# EAGLE board Mobo-v07 (EAGLE 5.09)
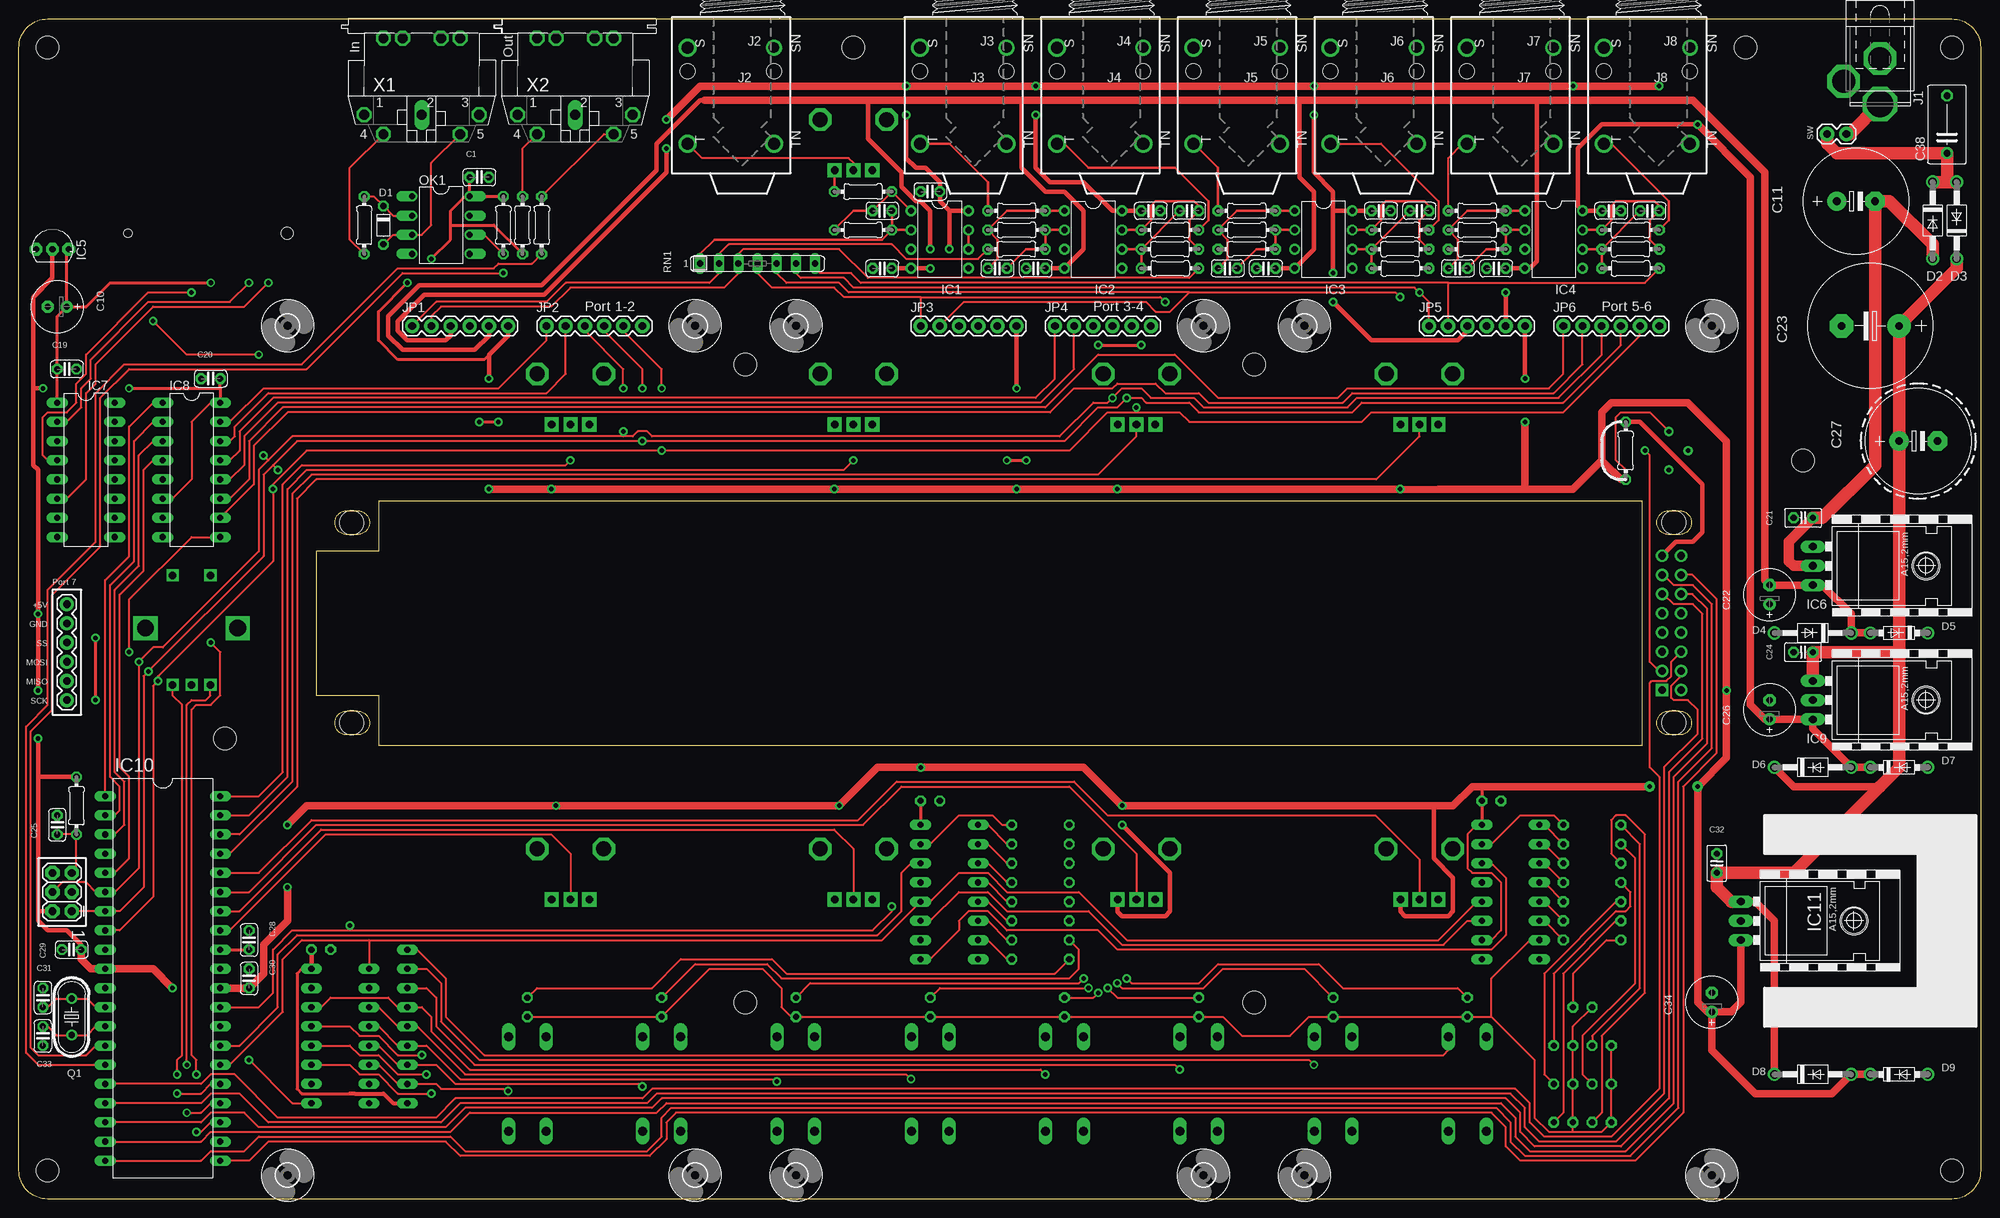
[diagram p5: board, top side]
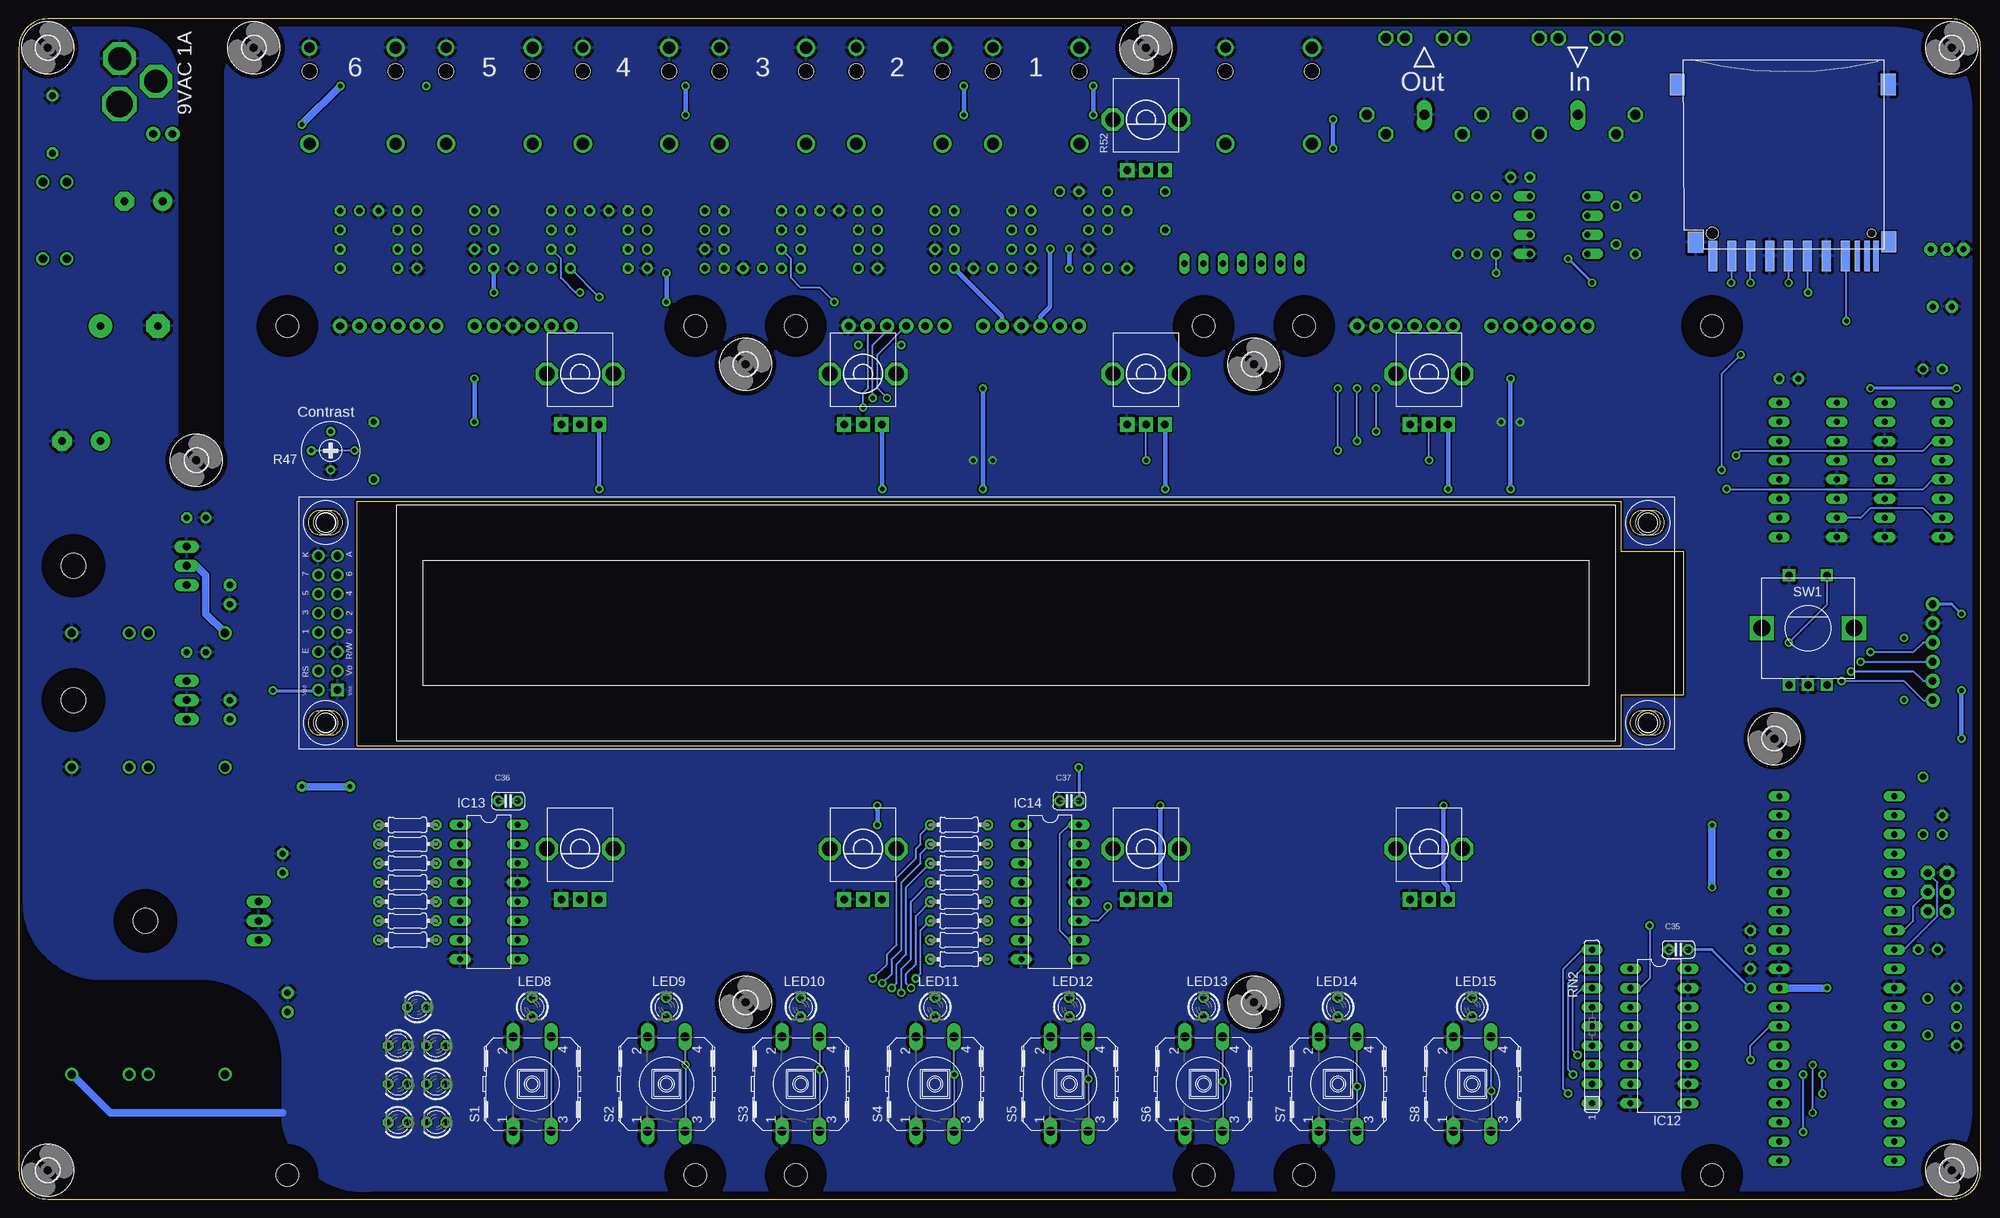
[diagram p6: board, bottom side, seen from below]

Size 259.71 x 156.21 mm. Coordinates in mm from the lower left corner, seen from the top.
Outline: 0,152.4 arc-90 3.81,156.21 255.91,156.21 arc-90 259.71,152.4 259.71,3.81 arc-90 255.91,0 3.81,0 arc-90 0,3.81 0,152.4
Outline: 214.95,60.01 214.95,92.39 47.62,92.39 47.62,85.72 39.37,85.72 39.37,66.67 47.62,66.67 47.62,60.01 214.95,60.01
Copper layers (1*16): Top 0.035mm / dielectric 1.5mm / Bottom 0.035mm
Design rules "SparkFun *": minimum track width 8mil, minimum drill 20mil, track to track 8mil, track to pad 8mil, pad to pad 8mil, via to via 8mil, smd to smd 8mil, copper to edge 10mil, drill to drill 8mil, minimum pad ring 12mil, minimum via ring 10mil, stop-mask expansion 4mil, vias tented up to drill 25mil, thermal gap 16mil

## Footprints (pad centres in the part's own frame; a part is rotated, then mirrored left to right if it is on the bottom)
C025-024X044 = drill 0.813 octagon: 1 -1.27,0; 2 1.27,0
E2,5-7 = drill 0.813 pad 1.6 round: + -1.27,0 | drill 0.813 pad 1.6 octagon: - 1.27,0
E5-13 = drill 1.016 pad 2.54 round: + -2.54,0 | drill 1.016 pad 2.54 octagon: - 2.54,0
C025-025X050 = drill 0.813 octagon: 1 -1.27,0; 2 1.27,0
E7,5-16 = drill 1.016 pad 3.15 round: + -3.81,0 | drill 1.016 pad 3.15 octagon: - 3.81,0
C075-052X106 = drill 0.914 octagon: 1 -3.81,0; 2 3.81,0
D-5 = drill 0.813 octagon: A 2.54,0; C -2.54,0
DO41-10 = drill 1.118 round: A 5.08,0; C -5.08,0
DO41-7.6 = drill 1.1 pad 1.7 round: A 3.81,0; C -3.81,0
DIL08 = drill 0.813 pad 1.27 round: 1 -3.81,-3.81; 2 -1.27,-3.81; 3 1.27,-3.81; 4 3.81,-3.81; 5 3.81,3.81; 6 1.27,3.81; 7 -1.27,3.81; 8 -3.81,3.81
TO92-INLINE = drill 0.813 pad 1.676 octagon: 1 -2.159,0; 2 0,0; 3 2.159,0
79XXL = drill 1.016 long: GND -2.54,-3.81; IN 0,-3.81; OUT 2.54,-3.81 | hole 3.302: 0,11.176
DIL16 = drill 0.813 long: 1 -8.89,-3.81; 2 -6.35,-3.81; 3 -3.81,-3.81; 4 -1.27,-3.81; 5 1.27,-3.81; 6 3.81,-3.81; 7 6.35,-3.81; 8 8.89,-3.81; 9 8.89,3.81; 10 6.35,3.81; 11 3.81,3.81; 12 1.27,3.81; 13 -1.27,3.81; 14 -3.81,3.81; 15 -6.35,3.81; 16 -8.89,3.81
78XXL = drill 1.016 long: GND 0,-3.81; IN -2.54,-3.81; OUT 2.54,-3.81 | hole 3.302: 0,11.176
DIL40 = drill 0.813 long: 1 -24.13,-7.62; 2 -21.59,-7.62; 3 -19.05,-7.62; 4 -16.51,-7.62; 5 -13.97,-7.62; 6 -11.43,-7.62; 7 -8.89,-7.62; 8 -6.35,-7.62; 9 -3.81,-7.62; 10 -1.27,-7.62; 11 1.27,-7.62; 12 3.81,-7.62; 13 6.35,-7.62; 14 8.89,-7.62; 15 11.43,-7.62; 16 13.97,-7.62; 17 16.51,-7.62; 18 19.05,-7.62; 19 21.59,-7.62; 20 24.13,-7.62; 21 24.13,7.62; 22 21.59,7.62; 23 19.05,7.62; 24 16.51,7.62; 25 13.97,7.62; 26 11.43,7.62; 27 8.89,7.62; 28 6.35,7.62; 29 3.81,7.62; 30 1.27,7.62; 31 -1.27,7.62; 32 -3.81,7.62; 33 -6.35,7.62; 34 -8.89,7.62; 35 -11.43,7.62; 36 -13.97,7.62; 37 -16.51,7.62; 38 -19.05,7.62; 39 -21.59,7.62; 40 -24.13,7.62
SPC4078_BIG_HOLES = drill 3.023 pad 4.318 octagon: 1 -0.46,0; 2 2.54,-4.8 | drill 3.531 pad 4.572 octagon: 3 5.54,0
NRJ4HF = drill 1.6 round: S 5.08,7.992; T -7.62,7.992; TN -7.62,-3.438 | drill 1.4 round: SN 5.08,-3.438 | hole 2: 1.948,7.992; 1.948,-3.438
1X06 = drill 1.016 pad 1.88 round: 1 0,0; 2 2.54,0; 3 5.08,0; 4 7.62,0; 5 10.16,0; 6 12.7,0
LED3MM = drill 0.813 octagon: A -1.27,0; K 1.27,0
DIL08' = drill 0.813 offset: 1 -3.81,-3.81; 2 -1.27,-3.81; 3 1.27,-3.81; 4 3.81,-3.81; 5 3.81,3.81; 6 1.27,3.81; 7 -1.27,3.81; 8 -3.81,3.81
HC49U-V = drill 0.813 round: 1 -2.413,0; 2 2.413,0
0204/7 = drill 0.813 octagon: 1 -3.81,0; 2 3.81,0
ALPS_POT_VERTICAL = drill 1 pad 1.88 square: P$1 -2.5,6.7; P$2 0,6.7; P$3 2.5,6.7 | drill 2 octagon: P$4 -4.4,0; P$5 4.4,0
RTRIM3339P = drill 0.61 round: 1 -2.54,0; 2 0,-2.54; 3 2.54,0
SIL7 = drill 0.813 long: 1 -7.62,0; 2 -5.08,0; 3 -2.54,0; 4 0,0; 5 2.54,0; 6 5.08,0; 7 7.62,0
SIL9 = drill 0.813 long: 1 -10.16,0; 2 -7.62,0; 3 -5.08,0; 4 -2.54,0; 5 0,0; 6 2.54,0; 7 5.08,0; 8 7.62,0; 9 10.16,0
B3F-40XX = drill 1.194 long: 1 -6.248,2.489; 2 6.248,2.489; 3 -6.248,-2.489; 4 6.248,-2.489
1X02 = drill 1.016 pad 1.88 round: 1 0,0; 2 2.54,0
ALPS_EC12E_SW = drill 1 square: A -2.5,-7.5; B 2.5,-7.5; C 0,-7.5; D -2.5,7; E 2.5,7 | drill 2.2 square: GND1 -6.1,0; GND2 6.1,0
2X3 = drill 1.016 pad 1.88 octagon: 1 0,0; 2 0,2.54; 3 2.54,0; 4 2.54,2.54; 5 5.08,0; 6 5.08,2.54
3,0 = hole 3: 0,0
LCD_MODULE_2X40 = drill 1.016 square: 1 1.54,-22.16 | drill 1.016 round: 2 -1,-22.16; 3 1.54,-19.62; 4 -1,-19.62; 5 1.54,-17.08; 6 -1,-17.08; 7 1.54,-14.54; 8 -1,-14.54; 9 1.54,-12; 10 -1,-12; 11 1.54,-9.46; 12 -1,-9.46; 13 1.54,-6.92; 14 -1,-6.92; 15 1.54,-4.38; 16 -1,-4.38 | hole 3.2: 0,-26.5; 175,-26.5; 175,0; 0,0.018
06132 = smd 1.2 x 4: 1 6.9,0.9; 2 4.4,0.9; 3 1.9,0.9; 4 -0.6,0.9; 5 -3.1,0.9; 6 -5.6,0.9; 7 -8.1,0.9; 9 9.4,0.9 | smd 0.7 x 4: 8 -9.7,0.9; CD -11,0.9; WP -12.2,0.9 | smd 2 x 2.8: GP -13.8,-21.8; GP2 14.1,-21.8; GP3 11.7,-0.9; GP4 -13.9,-1 | hole 1.1: -11.6,-2.1 | hole 1.6: 9.5,-2.1
MAB5SH = drill 1.321 octagon: 1 7.62,7.62; 3 -7.62,7.62; 4 5.08,10.16; 5 -5.08,10.16; P$1 -5.08,-2.54; P$2 -2.54,-2.54; P$3 2.54,-2.54; P$4 5.08,-2.54 | drill 1.321 long: 2 0,7.62

## Placement (x,y rotation side)
C1  100n  [C025-024X044]  60.96,135.25 0 top
C2  100n  [C025-024X044]  120.65,133.35 180 top
C3  100p  [C025-024X044]  114.3,130.81 180 top
C4  100n  [C025-024X044]  149.86,130.81 0 top
C5  100p  [C025-024X044]  154.94,130.81 0 top
C6  100n  [C025-024X044]  180.34,130.81 0 top
C7  100p  [C025-024X044]  185.42,130.81 0 top
C8  100n  [C025-024X044]  210.82,130.81 0 top
C9  100p  [C025-024X044]  215.9,130.81 0 top
C10  100u  [E2,5-7]  5.08,118.11 180 top
C11  2200u  [E5-13]  243.21,132.08 0 top
C12  100n  [C025-024X044]  114.3,123.19 0 top
C13  100p  [C025-024X044]  129.54,123.19 180 top
C14  100n  [C025-024X044]  134.62,123.19 0 top
C15  100p  [C025-024X044]  160.02,123.19 180 top
C16  100n  [C025-024X044]  165.1,123.19 0 top
C17  100p  [C025-024X044]  190.5,123.19 180 top
C18  100n  [C025-024X044]  195.58,123.19 0 top
C19  100n  [C025-024X044]  6.35,109.86 0 top
C20  100n  [C025-024X044]  25.4,108.58 180 top
C21  100n  [C025-025X050]  236.22,90.17 0 top
C22  100u  [E2,5-7]  231.78,80.01 90 top
C23  4700u  [E7,5-16]  245.11,115.57 180 top
C24  100n  [C025-025X050]  236.22,72.39 180 top
C25  100n  [C025-024X044]  5.08,49.53 90 top
C26  100u  [E2,5-7]  231.78,64.77 90 top
C27  2200u  [E5-13]  251.46,100.33 0 top
C28  100n  [C025-024X044]  30.48,34.29 90 top
C29  100n  [C025-024X044]  6.98,33.02 180 top
C30  100n  [C025-024X044]  30.48,29.21 90 top
C31  18p  [C025-024X044]  3.17,26.67 270 top
C32  100n  [C025-025X050]  224.79,44.45 90 top
C33  18p  [C025-024X044]  3.17,21.59 90 top
C34  100u  [E2,5-7]  224.16,26.04 90 top
C35  100n  [C025-024X044]  40.01,33.02 180 bottom
C36  100n  [C025-024X044]  194.94,52.7 180 bottom
C37  100n  [C025-024X044]  120.65,52.7 180 bottom
C38  1u  [C075-052X106]  255.27,142.24 90 top
D1  1N4148  [D-5]  48.26,128.91 270 top
D2  1N4004  [DO41-10]  253.36,129.54 270 top
D3  1N4004  [DO41-10]  256.54,129.54 90 top
D4  1N4004  [DO41-10]  237.49,74.93 180 top
D5  1N5819  [DO41-7.6]  248.92,74.93 180 top
D6  1N4004  [DO41-10]  237.49,57.15 0 top
D7  1N5819  [DO41-7.6]  248.92,57.15 0 top
D8  1N4004  [DO41-10]  237.49,16.51 0 top
D9  1N5819  [DO41-7.6]  248.92,16.51 0 top
IC1  TL072  [DIL08]  121.92,127 270 top
IC2  TL072  [DIL08]  142.24,127 270 top
IC3  TL072  [DIL08]  172.72,127 270 top
IC4  TL072  [DIL08]  203.2,127 270 top
IC5  MCP1700  [TO92-INLINE]  4.44,125.73 0 top
IC6  7908  [79XXL]  241.3,83.82 270 top
IC7  4050N  [DIL16]  8.89,96.52 270 top
IC8  74HC138N  [DIL16]  22.86,96.52 270 top
IC9  2940T-8.0  [78XXL]  241.3,66.04 270 top
IC10  ATMEGA644p  [DIL40]  19.05,29.21 270 top
IC11  7805  [78XXL]  231.78,36.83 270 top
IC12  74HC165N  [DIL16]  42.55,21.59 270 bottom
IC13  74HC595N  [DIL16]  197.49,40.64 270 bottom
IC14  74HC595N  [DIL16]  123.19,40.64 270 bottom
J1  [SPC4078_BIG_HOLES]  246.38,150.5 270 top
J2  MONOSWSLIM  [NRJ4HF]  96.52,147.32 90 top
J3  MONOSWSLIM  [NRJ4HF]  127.32,147.32 90 top
J4  MONOSWSLIM  [NRJ4HF]  145.41,147.32 90 top
J5  MONOSWSLIM  [NRJ4HF]  163.51,147.32 90 top
J6  MONOSWSLIM  [NRJ4HF]  181.61,147.32 90 top
J7  MONOSWSLIM  [NRJ4HF]  199.71,147.32 90 top
J8  MONOSWSLIM  [NRJ4HF]  217.81,147.32 90 top
JP1  [1X06]  52.07,115.57 0 top
JP2  [1X06]  69.85,115.57 0 top
JP3  [1X06]  119.38,115.57 0 top
JP4  [1X06]  137.16,115.57 0 top
JP5  [1X06]  186.69,115.57 0 top
JP6  [1X06]  204.47,115.57 0 top
JP7  [1X06]  6.35,66.04 90 top
LED1  [LED3MM]  209.55,10.16 180 bottom
LED2  [LED3MM]  204.47,10.16 180 bottom
LED3  [LED3MM]  209.55,15.24 180 bottom
LED4  [LED3MM]  204.47,15.24 180 bottom
LED5  [LED3MM]  209.55,20.32 180 bottom
LED6  [LED3MM]  204.47,20.32 180 bottom
LED7  [LED3MM]  207.01,25.4 180 bottom
LED8  [LED3MM]  191.77,25.4 270 bottom
LED9  [LED3MM]  173.99,25.4 270 bottom
LED10  [LED3MM]  156.21,25.4 270 bottom
LED11  [LED3MM]  138.43,25.4 270 bottom
LED12  [LED3MM]  120.65,25.4 270 bottom
LED13  [LED3MM]  102.87,25.4 270 bottom
LED14  [LED3MM]  85.09,25.4 270 bottom
LED15  [LED3MM]  67.31,25.4 270 bottom
OK1  6N137  [DIL08']  55.88,128.91 270 top
Q1  20MHz  [HC49U-V]  6.98,24.13 90 top
R1  68  [0204/7]  111.76,133.35 180 top
R2  68  [0204/7]  132.08,130.81 180 top
R3  68  [0204/7]  162.56,130.81 180 top
R4  68  [0204/7]  193.04,130.81 180 top
R5  220  [0204/7]  45.72,128.91 90 top
R6  10k  [0204/7]  64.14,128.91 90 top
R8  220  [0204/7]  66.67,128.91 270 top
R9  220  [0204/7]  69.22,128.91 90 top
R10  10k  [0204/7]  111.76,128.27 180 top
R11  10k  [0204/7]  132.08,128.27 180 top
R12  68  [0204/7]  152.4,128.27 0 top
R13  10k  [0204/7]  162.56,128.27 180 top
R14  68  [0204/7]  182.88,128.27 0 top
R15  10k  [0204/7]  193.04,128.27 180 top
R16  68  [0204/7]  213.36,128.27 0 top
R17  10k  [0204/7]  132.08,125.73 0 top
R18  10k  [0204/7]  152.4,125.73 0 top
R19  10k  [0204/7]  162.56,125.73 0 top
R20  10k  [0204/7]  182.88,125.73 0 top
R21  10k  [0204/7]  193.04,125.73 0 top
R22  10k  [0204/7]  213.36,125.73 0 top
R23  10k  [0204/7]  152.4,123.19 180 top
R24  10k  [0204/7]  182.88,123.19 180 top
R25  10k  [0204/7]  213.36,123.19 180 top
R26  0  [0204/7]  212.72,99.06 90 top
R27  10k  [0204/7]  7.62,52.07 90 top
R28  470  [0204/7]  135.25,31.75 180 bottom
R29  470  [0204/7]  208.28,34.29 180 bottom
R30  470  [0204/7]  135.25,34.29 180 bottom
R31  470  [0204/7]  208.28,36.83 180 bottom
R32  470  [0204/7]  135.25,36.83 180 bottom
R33  470  [0204/7]  208.28,39.37 180 bottom
R34  470  [0204/7]  135.25,39.37 180 bottom
R35  470  [0204/7]  208.28,41.91 180 bottom
R36  470  [0204/7]  135.25,41.91 180 bottom
R37  470  [0204/7]  208.28,44.45 180 bottom
R38  470  [0204/7]  135.25,44.45 180 bottom
R39  POT  [ALPS_POT_VERTICAL]  185.42,46.35 180 bottom
R40  POT  [ALPS_POT_VERTICAL]  147.96,46.35 180 bottom
R41  POT  [ALPS_POT_VERTICAL]  110.49,46.35 180 bottom
R42  POT  [ALPS_POT_VERTICAL]  73.03,46.35 180 bottom
R43  470  [0204/7]  208.28,46.99 180 bottom
R44  470  [0204/7]  135.25,46.99 180 bottom
R45  470  [0204/7]  208.28,49.53 180 bottom
R46  470  [0204/7]  135.25,49.53 180 bottom
R47  5k  [RTRIM3339P]  218.44,99.06 270 bottom
R48  POT  [ALPS_POT_VERTICAL]  185.42,109.22 180 bottom
R49  POT  [ALPS_POT_VERTICAL]  147.96,109.22 180 bottom
R50  POT  [ALPS_POT_VERTICAL]  110.49,109.22 180 bottom
R51  POT  [ALPS_POT_VERTICAL]  73.03,109.22 180 bottom
R52  100kA  [ALPS_POT_VERTICAL]  110.49,142.88 180 bottom
RN1  10k  [SIL7]  97.79,123.83 0 top
RN2  10k  [SIL9]  51.44,22.86 90 bottom
S1  [B3F-40XX]  191.77,15.24 90 bottom
S2  [B3F-40XX]  173.99,15.24 90 bottom
S3  [B3F-40XX]  156.21,15.24 90 bottom
S4  [B3F-40XX]  138.43,15.24 90 bottom
S5  [B3F-40XX]  120.65,15.24 90 bottom
S6  [B3F-40XX]  102.87,15.24 90 bottom
S7  [B3F-40XX]  85.09,15.24 90 bottom
S8  [B3F-40XX]  67.31,15.24 90 bottom
SW  [1X02]  241.94,140.97 180 top
SW1  Encoder  [ALPS_EC12E_SW]  22.86,75.56 0 bottom
U1  ISP  [2X3]  6.98,38.1 90 top
U$1  [SARASWATI_LARGE]  11.43,133.35 0 top
U$2  [D02A-L]  247.02,83.82 180 top
U$3  [D02A-L]  247.02,66.04 180 top
U$4  [D02A-L]  237.49,36.83 180 top
U$5  [3,0]  224.16,3.18 0 top
U$6  [3,0]  170.18,3.18 0 top
U$7  [3,0]  156.84,3.18 0 top
U$8  [3,0]  102.87,3.18 0 top
U$9  [3,0]  89.53,3.18 0 top
U$10  [3,0]  35.56,3.18 0 top
U$11  [3,0]  255.91,3.81 0 bottom
U$12  [3,0]  3.81,3.81 0 bottom
U$13  LCD_MODULE  [LCD_MODULE_2X40]  219.07,89.53 0 bottom
U$14  [3,0]  27.3,60.96 0 bottom
U$15  [3,0]  224.16,115.57 0 top
U$16  [3,0]  170.18,115.57 0 top
U$17  [3,0]  156.84,115.57 0 top
U$18  [3,0]  102.87,115.57 0 top
U$19  [3,0]  89.53,115.57 0 top
U$20  [3,0]  35.56,115.57 0 top
U$21  [3,0]  96.2,110.49 0 bottom
U$22  SDMMC06132  [06132]  26.04,125.73 180 bottom
U$23  [3,0]  255.91,152.4 0 bottom
U$24  [3,0]  228.6,152.4 0 bottom
U$25  [3,0]  110.49,152.4 0 bottom
U$26  [3,0]  3.81,152.4 0 bottom
U$27  [3,0]  163.51,110.49 0 bottom
U$28  [3,0]  163.51,26.04 0 bottom
U$29  [3,0]  96.2,26.04 0 bottom
U$30  [3,0]  236.22,97.79 0 bottom
X1  MIDI  [MAB5SH]  53.34,151.13 180 top
X2  MIDI  [MAB5SH]  73.66,151.13 180 top

## Tracks (layer width: path | path; a pad name or v marks a point on that pad's centre or on a via)
+3V3  (via drill 0.6)
  Top 0.406: IC7.1 C19.1 5.08,116.84 C10.+ | IC5.3 6.35,125.48 C10.+ | C10.+ 8.89,118.11 12.06,121.28 v25.4,121.28
  Bottom 0.254: 25.44,125.13 U$22.4 25.4,124.79 v25.4,121.28
+5V  (via drill 0.6, 0.6 pad 1.42)
  Top 0.254: IC8.6 20.32,92.71 22.86,95.25 22.86,102.87 25.4,105.41 | IC13.10 194.94,34.29 196.22,35.56 196.22,41.91 194.94,43.18 192.41,43.18 191.77,43.81 191.77,48.26 193.04,49.53 | R47.1 215.9,104.14 212.09,104.14 211.46,103.5 211.46,97.79 212.72,96.52 R26.1
  Top 0.406: OK1.8 R6.2 | C37.1 IC14.16 | 44.45,13.97 37.47,13.97 36.83,14.6 36.83,29.85 37.47,30.48 IC12.16 | 193.04,49.53 IC13.16 C36.1 193.68,54.61 | 25.4,105.41 IC8.16 26.67,107.31 | OK1.8 C1.1 | v51.44,121.28 47.62,117.47 47.62,113.66 50.17,111.12 61.59,111.12 62.23,111.76 | v54.61,124.46 57.15,127 57.15,128.91 | 57.15,128.91 57.15,130.81 59.06,132.72 OK1.8 | v14.6,107.31 26.67,107.31 | 26.67,107.31 C20.1 | R8.2 62.86,128.91 57.15,128.91
  Top 0.508: 43.81,13.97 44.45,13.97 48.26,13.97 49.53,12.7 RN2.1
  Top 0.61: C35.1 IC12.16 | v199.39,108.58 JP5.6 | v132.08,107.31 JP3.6 | v2.54,67.31 v2.54,77.47 2.54,96.52 1.9,97.16 1.9,107.31 | v62.23,108.58 62.23,111.76 64.77,114.3 JP1.6 | C29.1 8.26,33.66 6.35,35.56 3.81,35.56 2.54,36.83 2.54,38.1 | 2.54,38.1 2.54,55.88 | 2.54,55.88 v2.54,60.96 | 2.54,38.1 U1.2 | 2.54,55.88 R27.2 | 1.9,107.31 v3.17,107.31 | 1.9,107.31 1.9,119.38 4.44,121.92 IC5.2 | R39.P$1 182.88,39.61 182.88,38.1 183.52,37.46 189.23,37.46 189.87,38.1 189.87,42.54 187.32,45.09 187.32,52.07 | v146.05,49.53 152.4,43.18 152.4,38.1 151.77,37.46 146.05,37.46 145.46,38.06 R40.P$1
  Top 0.914: v182.88,93.98 187.96,93.98
  Top 1.016: v20.32,27.94 17.78,30.48 IC10.10 9.53,30.48 8.26,31.75 C29.1 | v35.56,49.53 38.1,52.07 v71.12,52.07 v108.59,52.07 113.67,57.15 v119.38,57.15 140.97,57.15 v146.05,52.07 187.32,52.07 189.87,52.07 192.41,54.61 193.68,54.61 v215.9,54.61 214,54.61 | v35.56,41.27 35.56,36.83 32.38,33.66 32.38,29.85 C30.1 IC10.30 | v182.88,93.98 v145.41,93.98 v132.08,93.98 v107.95,93.98 v70.48,93.98 v62.23,93.98 | 187.96,93.98 199.39,93.98 | 199.39,93.98 v199.39,102.87 | C34.+ 223.52,24.77 222.25,26.04 v222.25,54.61 226.06,58.42 v226.06,67.31 226.06,100.33 220.98,105.41 210.82,105.41 209.55,104.14 209.55,97.79 209.23,97.47 | IC11.OUT 227.97,26.04 226.69,24.77 C34.+ | D9.C D8.A 240.03,13.97 229.87,13.97 224.16,19.69 C34.+ | 199.39,93.98 205.74,93.98 209.23,97.47 | R26.1 212.09,95.25 209.87,97.47 209.23,97.47
  Bottom 0.254: IC14.10 120.65,34.29 121.92,35.56 121.92,48.26 120.65,49.53
  Bottom 0.406: v119.38,57.15 C37.1 | IC14.16 120.65,49.53 | v2.54,77.47 3.81,78.74 JP7.6 | v51.44,121.28 v54.61,124.46 | v3.17,107.31 v14.6,107.31 | C35.1 35.56,33.02 C30.1 | v226.06,67.31 220.14,67.31
  Bottom 0.61: R51.P$1 70.48,102.48 v70.48,93.98 70.53,94.02 | v71.12,52.07 71.12,41.91 70.53,41.31 R42.P$1 | v108.59,52.07 108.59,41.91 107.99,41.31 R41.P$1 | v107.95,93.98 107.95,102.48 R50.P$1 | v145.41,93.98 145.41,102.48 R49.P$1 | v182.88,93.98 182.88,102.48 R48.P$1 | v62.23,93.98 v62.23,108.58 | v199.39,102.87 v199.39,108.58 | v132.08,107.31 v132.08,93.98 | v2.54,60.96 v2.54,67.31 | v146.05,52.07 v146.05,49.53
  Bottom 1.016: IC10.30 v20.32,27.94 | v35.56,49.53 v35.56,41.27 | v222.25,54.61 v215.9,54.61 | 220.14,67.31 U$13.2
AUDIO0
  Top 0.254: R17.1 127,124.46 117.47,124.46 115.57,126.37 93.98,126.37 92.71,125.09 RN1.2 92.71,122.55 91.44,121.28 72.39,121.28 69.85,118.75 55.25,118.75 JP1.1
AUDIO1
  Top 0.254: R23.1 154.94,121.92 112.39,121.92 108.59,125.73 95.89,125.73 95.25,125.09 RN1.3 95.25,122.55 93.34,120.65 73.03,120.65 70.48,118.11 55.88,118.11 54.61,116.84 JP1.2
AUDIO2  (via drill 0.6)
  Top 0.254: v151.77,118.75 151.13,119.38 119.38,119.38 | 119.38,119.38 JP3.1 | 119.38,119.38 109.22,119.38 107.95,120.65 99.7,120.65 97.79,122.55 RN1.4
  Bottom 0.254: v151.77,118.75 153.67,120.65 156.21,120.65 157.48,121.92 157.48,124.46 R19.1
AUDIO3  (via drill 0.6)
  Top 0.254: v182.88,119.38 182.25,120.02 154.94,120.02 | 154.94,120.02 152.4,117.47 150.5,117.47 149.22,118.75 125.09,118.75 JP3.2 | 154.94,120.02 109.86,120.02 108.59,121.28 101.6,121.28 100.33,122.55 RN1.5
  Bottom 0.254: v182.88,119.38 R24.1
AUDIO4  (via drill 0.6)
  Top 0.254: JP5.1 186.69,118.75 v185.42,120.02 184.78,120.65 110.49,120.65 109.22,121.92 103.5,121.92 102.87,122.55 RN1.6
  Bottom 0.254: v185.42,120.02 186.06,120.02 187.96,121.92 187.96,124.46 R21.1
AUDIO5
  Top 0.254: R25.1 215.27,121.28 189.23,121.28 | 189.23,121.28 111.44,121.28 110.17,122.55 106.05,122.55 105.41,123.19 RN1.7 | JP5.2 189.23,121.28
ENC_A  (via drill 0.6)
  Top 0.254: IC10.24 25.4,12.7 24.13,11.43 v22.23,11.43 | v22.23,17.78 22.23,65.41 22.86,66.04 24.77,66.04 25.36,66.63 SW1.A
  Bottom 0.254: v22.23,11.43 v22.23,17.78
ENC_B  (via drill 0.6)
  Top 0.254: IC10.25 25.4,15.24 24.13,13.97 v20.95,13.97 | v20.95,16.51 20.95,18.42 21.59,19.05 21.59,65.41 20.36,66.63 SW1.B
  Bottom 0.254: v20.95,13.97 v20.95,16.51
ENC_CLICK  (via drill 0.6)
  Top 0.254: v25.4,73.66 26.67,72.39 26.67,66.67 25.4,65.41 23.5,65.41 22.86,64.77 22.86,19.05 23.5,18.42 v23.5,16.51 | v23.5,8.89 24.13,8.89 25.4,10.16 IC10.23
  Bottom 0.254: SW1.E 20.32,82.52 20.32,78.74 v25.4,73.66 | v23.5,8.89 v23.5,16.51
GND  (via drill 0.6)
  Top 0.406: v60.96,102.87 v63.5,102.87 | v130.81,97.79 v133.35,97.79
  Bottom 1.016: D9.A 247.65,11.43 224.79,11.43
  pour Bottom: 1.27,144.78 arc-90 11.43,154.94 226.06,154.94 arc-90 232.41,148.59 232.41,97.16 arc90 235.59,93.98 arc90 238.76,97.16 238.76,148.59 arc-90 245.11,154.94 252.73,154.94 arc-90 259.08,148.59 259.08,39.37 arc-90 248.92,29.21 234.95,29.21 arc90 224.79,17.78 224.79,10.16 arc-90 212.09,1.27 11.43,1.27 arc-90 1.27,11.43
GND1  (via drill 0.6)
  Top 0.406: v142.88,113.03 v148.59,113.03
GND4  (via drill 0.6)
  Top 0.406: v10.16,66.04 v10.16,74.3
IO_ENABLE
  Top 0.254: IC13.12 193.04,39.37 187.96,34.29 146.69,34.29 140.34,40.64 130.81,40.64 128.27,43.18 124.46,43.18 120.65,39.37 IC14.12 114.3,34.29 46.36,34.29 | 46.36,34.29 IC12.1 | IC10.26 27.94,17.78 34.93,24.77 34.93,31.75 37.47,34.29 46.36,34.29
IO_INPUT  (via drill 0.6)
  Top 0.254: v30.48,18.42 36.2,12.7 IC12.9
  Bottom 0.254: IC10.28 27.94,22.86 30.48,20.32 v30.48,18.42
IO_OUTPUT
  Top 0.254: IC14.14 118.11,44.45 116.84,43.18 116.84,38.1 113.67,34.92 36.83,34.92 34.29,32.38 34.29,25.4 29.21,20.32 IC10.27
IO_SCK  (via drill 0.6)
  Top 0.254: IC13.11 191.77,36.83 188.59,33.66 146.05,33.66 141.6,38.1 130.81,38.1 128.27,40.64 124.46,40.64 120.65,36.83 IC14.11 | v115.57,38.73 115.57,38.1 113.03,35.56 43.81,35.56 | 43.81,35.56 v43.81,36.2 | IC10.29 31.75,25.4 33.66,27.3 33.66,33.02 36.2,35.56 43.81,35.56
  Bottom 0.254: IC12.2 45.09,27.94 43.81,29.21 v43.81,36.2 | v115.57,38.73 115.57,38.1 116.84,36.83 IC14.11
LCD_DATA4
  Top 0.254: IC10.18 24.13,10.16 25.4,11.43 29.84,11.43 31.75,9.53 56.52,9.53 59.06,12.06 83.82,12.06 85.09,13.33 196.85,13.33 198.75,11.43 198.75,8.89 200.66,6.98 212.09,6.98 218.44,13.33 218.44,56.52 222.88,60.96 222.88,77.47 221.62,78.74 219.07,78.74 217.74,80.08 U$13.11
LCD_DATA5
  Top 0.254: IC10.19 24.13,7.62 25.4,8.89 57.15,8.89 59.69,11.43 84.45,11.43 85.72,12.7 196.22,12.7 198.12,10.79 198.12,8.25 200.03,6.35 212.72,6.35 219.07,12.7 219.07,55.88 223.52,60.33 223.52,78.11 221.55,80.08 U$13.12
LCD_DATA6
  Top 0.254: IC10.20 24.13,5.08 25.4,6.35 29.84,6.35 31.75,8.25 57.15,8.25 59.06,6.35 83.19,6.35 85.09,8.25 85.09,10.79 86.36,12.06 195.58,12.06 197.49,10.16 197.49,7.62 199.39,5.71 213.36,5.71 219.71,12.06 219.71,55.24 224.16,59.69 224.16,78.74 221.62,81.28 219.07,81.28 217.74,82.61 U$13.13
LCD_DATA7
  Top 0.254: U$13.14 221.55,82.61 224.79,79.38 224.79,59.05 220.34,54.61 220.34,11.43 214,5.08 198.75,5.08 196.85,6.98 196.85,9.53 194.94,11.43 87,11.43 85.72,10.16 85.72,7.94 83.5,5.71 58.42,5.71 56.52,7.62 33.02,7.62 30.48,5.08 IC10.21
LCD_ENABLE
  Top 0.254: IC10.16 24.13,15.24 25.4,16.51 28.58,16.51 34.29,10.79 55.25,10.79 57.78,13.33 82.55,13.33 83.82,14.6 198.12,14.6 200.03,12.7 200.03,10.16 201.93,8.25 210.82,8.25 217.17,14.6 217.17,55.88 215.9,57.15 215.9,68.26 216.22,68.58 218.12,68.58 218.76,69.22 218.76,71.12 220.07,72.44 U$13.6
LCD_RS
  Top 0.254: IC10.17 24.13,12.7 25.4,13.97 29.21,13.97 33.02,10.16 55.88,10.16 58.42,12.7 83.19,12.7 84.45,13.97 197.49,13.97 199.39,12.06 199.39,9.53 201.29,7.62 211.46,7.62 217.81,13.97 217.81,57.15 222.25,61.59 222.25,64.77 220.98,66.04 219.07,66.04 218.76,66.36 218.76,67.94 220.07,69.26 U$13.4 220.07,69.9
MIDI_IN  (via drill 0.6)
  Top 0.254: IC10.14 10.16,20.32 8.89,19.05 2.54,19.05 1.59,20 1.59,61.91 4.44,64.77 4.44,80.01 10.79,86.36 10.79,106.05 14.6,109.86 38.1,109.86 50.8,122.55 v64.14,122.55 | OK1.6 61.59,127.63 R6.1
  Bottom 0.254: v64.14,122.55 R6.1
MIDI_OUT
  Top 0.254: IC10.15 2.54,17.78 0.95,19.37 0.95,62.55 3.81,65.41 3.81,80.64 10.16,87 10.16,106.68 13.97,110.49 37.47,110.49 50.17,123.19 62.86,123.19 63.5,123.83 67.95,123.83 R9.1
MISO  (via drill 0.6)
  Top 0.254: 33.66,97.16 36.83,100.33 v82.55,100.33 138.43,100.33 142.88,104.77 145.41,104.77 v146.69,106.05 148.59,106.05 149.22,105.41 154.94,105.41 156.21,104.14 176.53,104.14 177.8,105.41 204.47,105.41 212.09,113.03 JP6.4 | 33.66,97.16 32.38,95.88 32.38,85.09 v17.14,69.85 16.51,69.22 16.51,41.27 13.33,38.1 IC10.7 U1.1 | 33.66,97.16 v34.29,96.52 | v82.55,107.31 82.55,109.86 77.47,114.94 JP2.4 | v17.78,116.2 22.23,111.76 v31.75,111.76
  Bottom 0.254: v146.69,106.05 146.69,113.03 144.78,114.94 JP4.4 | U$22.7 17.94,124.62 17.78,124.46 v17.78,116.2 | JP7.2 7.62,68.58 8.89,69.85 v17.14,69.85 | v82.55,100.33 v82.55,107.31 | v31.75,111.76 34.29,109.22 v34.29,96.52
MOSI  (via drill 0.6)
  Top 0.254: 80.01,100.97 81.28,100.97 81.92,101.6 83.19,101.6 83.82,100.97 137.79,100.97 142.24,105.41 144.15,105.41 v144.78,106.05 146.05,107.31 148.59,107.31 149.86,106.05 155.57,106.05 156.84,104.77 175.9,104.77 177.16,106.05 203.84,106.05 209.55,111.76 JP6.3 | 80.01,100.97 36.2,100.97 33.02,97.79 | U1.4 5.71,41.91 8.89,41.91 10.16,40.64 IC10.6 12.7,40.64 15.87,43.81 v15.87,71.12 17.78,73.02 19.05,73.02 31.75,85.72 31.75,96.52 33.02,97.79 | 80.01,100.97 v80.01,101.6 | 33.02,97.79 v32.38,98.42 | JP2.3 74.93,114.94 80.01,109.86 v80.01,107.31
  Bottom 0.254: v144.78,106.05 146.05,107.31 146.05,111.76 JP4.3 | v15.87,71.12 JP7.3 | IC7.3 6.35,100.33 7.62,99.06 31.75,99.06 v32.38,98.42 | v80.01,101.6 v80.01,107.31
MOSI_3V3  (via drill 0.6)
  Top 0.254: v30.48,121.28 27.94,118.75 17.14,118.75 9.53,111.12 9.53,108.58 8.26,107.31 8.26,104.77 6.35,102.87 IC7.2
  Bottom 0.254: v30.48,121.28 30.48,124.78 U$22.2
N$1
  Top 0.254: IC14.2 128.27,46.99 130.81,44.45 R38.1
N$2  (via drill 0.6)
  Top 0.254: IC12.3 47.62,25.4 50.17,22.86 RN2.5 52.7,22.86 59.06,16.51 117.47,16.51 v118.11,15.87 118.16,15.87
  Bottom 0.254: S5.4 118.11,21.44 v118.11,15.87 118.11,9.04 S5.3
N$3  (via drill 0.6)
  Top 0.254: IC12.5 47.62,20.32 50.17,17.78 RN2.3 55.25,17.78 57.78,15.24 82.23,15.24 v82.55,14.92
  Bottom 0.254: S7.3 82.6,9.47 82.55,9.53 v82.55,14.92 82.55,21.44 S7.4
N$4
  Top 1.676: J1.3 242.4,140.97 SW.1
N$5
  Top 0.254: R9.2 77.47,140.97 X2.5
N$6
  Top 0.305: IC1.1 R1.1 C3.2 110.49,130.81 R10.2
N$7
  Top 0.406: IC10.32 C28.1
N$9
  Top 0.305: R10.1 114.94,128.27 | R10.1 IC1.2 | RN1.1 90.17,125.09 92.08,127 114.3,127 R10.1 | R10.1 C3.1
N$10  (via drill 0.6)
  Top 0.254: IC12.4 47.62,22.86 50.17,20.32 RN2.4 53.97,20.32 58.42,15.87 100.01,15.87 v100.33,15.56
  Bottom 0.254: S6.4 100.33,21.44 v100.33,15.56 100.33,9.04 S6.3
N$11
  Top 0.305: R1.2 107.99,133.39 R52.P$1
N$12  (via drill 0.6)
  Top 0.254: IC12.14 40.01,25.4 41.27,26.67 48.9,26.67 50.17,25.4 RN2.6 53.34,25.4 54.61,24.13 54.61,22.23 59.69,17.14 135.25,17.14 v135.89,16.51 135.94,16.51
  Bottom 0.254: S4.3 135.89,9.04 v135.89,16.51 135.89,21.44 S4.4
N$14
  Top 0.305: IC4.1 R4.1 191.77,130.81 R15.2 190.5,127 190.5,124.46 C17.2
N$16
  Top 0.305: IC2.2 R11.1 R17.2 133.35,125.73 C13.1
N$17
  Top 0.305: C13.2 129.54,124.46 129.54,127 R11.2 130.81,130.81 R2.1 IC2.1
N$18  (via drill 0.6)
  Top 0.254: U$13.3 217.1,69.91 215.9,71.12 215.9,98.42 v215.27,99.06
  Bottom 0.254: v215.27,99.06 R47.2
N$19
  Top 0.305: R2.2 128.27,134.62 123.19,139.7 J3.T
N$20
  Top 1.422: IC6.IN 234.95,83.82 234.31,84.45 234.31,87 C21.2
  Top 1.676: C21.2 238.76,90.17 245.74,97.16 C11.- 247.65,132.08 253.36,126.37 D2.A
  Bottom 1.016: D4.A 234.95,77.47 234.95,82.55 236.22,83.82 IC6.IN
N$23
  Top 0.305: C15.1 163.83,125.73 R19.2 R13.1 IC3.2
N$24  (via drill 0.6)
  Top 0.254: IC12.11 43.81,17.78 45.09,16.51 47.62,16.51 50.17,13.97 v54.61,13.97 | RN2.9 52.7,33.02 56.52,29.21 56.52,24.13 61.59,19.05 188.59,19.05 189.28,19.74 S1.4
  Bottom 0.254: v54.61,13.97 55.25,14.6 55.25,30.48 52.7,33.02 RN2.9 | S1.4 S1.3
N$25
  Top 1.016: D6.C 234.95,54.61 246.38,54.61 | D8.C 232.41,36.83 229.87,39.37 IC11.IN
  Top 1.676: IC9.IN C24.1 248.92,72.39 | 248.92,72.39 248.92,57.15 246.38,54.61 234.95,43.18 C32.1 224.79,41.27 226.69,39.37 IC11.IN | 248.92,72.39 C27.+ C23.+ 256.54,123.19 D3.C
N$26
  Top 0.305: IC2.6 R18.1 | R18.1 R23.2 | R18.1 C5.1
N$27
  Top 0.305: IC2.7 R12.1 149.86,129.54 149.86,131.44 150.5,132.08 155.57,132.08 156.21,131.44 C5.2 154.94,129.54 154.94,127 R18.2
N$28
  Top 0.254: R5.2 46.99,132.72 D1.C 49.53,130.18 OK1.2
N$29
  Top 1.676: 255.27,134.62 C38.1 240.66,138.43 239.4,139.7 SW.2 | 255.27,134.62 D3.A | 255.27,134.62 D2.C
N$30
  Top 0.254: IC14.15 120.65,46.99 124.46,50.8 128.91,50.8 130.18,49.53 R46.1
N$31
  Top 0.254: IC14.1 128.27,49.53 130.81,46.99 R44.1
N$32
  Top 0.305: R12.2 157.48,129.54 157.48,132.08 153.03,136.53 141.6,136.53 138.43,139.7 J4.T
N$33
  Top 0.254: IC14.3 128.27,44.45 130.81,41.91 R36.1
N$34
  Top 0.254: IC14.4 128.27,41.91 130.81,39.37 R34.1
N$35
  Top 0.254: IC14.5 128.27,39.37 130.81,36.83 R32.1
N$36
  Top 0.254: IC14.7 128.27,34.29 130.81,31.75 R28.1
N$37
  Top 0.254: IC14.6 128.27,36.83 130.81,34.29 R30.1
N$38
  Top 0.305: C15.2 160.02,124.46 160.02,127 R13.2 161.29,130.81 R3.1 IC3.1
N$40
  Top 0.305: R3.2 158.75,136.53 155.57,139.7 J5.T
N$41
  Top 0.254: J2.T 90.43,137.79 109.86,137.79 110.49,137.16 R52.P$2
N$42  (via drill 0.6)
  Top 0.254: LED8.A 190.5,27.94 175.26,27.94 172.09,31.11 158.75,31.11 156.21,28.57 147.32,28.57 v146.69,29.21
  Bottom 0.254: R46.2 140.34,48.26 140.34,46.99 140.97,46.35 140.97,45.09 143.51,42.54 143.51,33.66 144.78,32.38 144.78,31.11 v146.69,29.21
N$43  (via drill 0.6)
  Top 0.254: v145.41,28.57 146.05,27.94 156.84,27.94 159.38,30.48 170.18,30.48 LED9.A
  Bottom 0.254: R44.2 140.34,45.72 140.34,44.45 142.88,41.91 142.88,33.02 144.15,31.75 144.15,29.85 v145.41,28.57
N$44  (via drill 0.6)
  Top 0.254: LED10.A 145.41,26.67 v144.15,27.94
  Bottom 0.254: R38.2 142.24,41.27 142.24,32.38 143.51,31.11 143.51,28.57 v144.15,27.94
N$45  (via drill 0.6)
  Top 0.254: LED11.A 142.24,26.67 v142.88,27.3
  Bottom 0.254: R36.2 141.6,39.37 141.6,31.75 142.88,30.48 v142.88,27.3
N$46  (via drill 0.6)
  Top 0.254: v141.6,27.94 121.92,27.94 LED12.A
  Bottom 0.254: v141.6,27.94 142.24,28.57 142.24,29.85 140.97,31.11 140.97,37.46 R34.2
N$47  (via drill 0.6)
  Top 0.254: LED13.A 104.78,28.57 140.34,28.57 v140.97,29.21
  Bottom 0.254: v140.97,29.21 140.34,29.85 140.34,35.56 R32.2
N$48
  Top 0.254: LED14.A 89.53,31.11 99.06,31.11 100.97,29.21 139.06,29.21 140.34,30.48 140.34,33.02 R30.2
N$49
  Top 0.254: LED15.A 68.58,27.94 83.82,27.94 87.63,31.75 99.7,31.75 101.6,29.85 137.16,29.85 R28.2
N$51
  Top 0.254: LED15.K LED14.K 91.44,30.48 98.42,30.48 100.97,27.94 100.97,25.4 102.23,24.13 LED13.K LED12.K LED11.K LED10.K 159.38,24.13 161.93,21.59 168.28,21.59 170.81,24.13 LED9.K LED8.K 194.94,24.13 | LED5.K LED3.K LED1.K 209.55,8.89 205.74,8.89 | 205.74,8.89 LED2.K LED4.K LED6.K 205.74,22.86 LED7.K | 205.74,8.89 202.56,8.89 200.66,10.79 200.66,18.42 194.94,24.13 | IC13.7 200.03,34.29 194.94,29.21 194.94,24.13
N$54
  Top 0.305: R20.1 R24.2 | IC3.6 R20.1 | R20.1 C7.1
N$55
  Top 0.305: IC3.7 R14.1 180.34,129.54 180.34,131.44 180.97,132.08 186.06,132.08 186.69,131.44 C7.2 185.42,129.54 185.42,127 R20.2
N$57
  Top 0.254: R14.2 187.96,129.54 187.96,132.08 180.34,139.7 J6.T
N$60
  Top 0.305: IC4.2 R15.1 R21.2 194.31,125.73 C17.1
N$62
  Top 0.254: IC13.15 194.94,46.99 198.75,50.8 203.2,50.8 R45.1
N$63
  Top 0.254: IC13.1 201.93,49.53 R43.1
N$64
  Top 0.254: R4.2 189.23,137.79 191.13,139.7 J7.T
N$67
  Top 0.254: IC13.3 201.93,44.45 R35.1
N$68
  Top 0.254: R8.1 66.67,139.06 X2.4
N$69
  Top 0.254: IC13.4 201.93,41.91 R33.1
N$70
  Top 0.254: IC13.5 201.93,39.37 R31.1
N$71
  Top 0.305: R22.1 R25.2 | IC4.6 R22.1 | R22.1 C9.1
N$72
  Top 0.254: X1.4 43.81,136.53 43.81,127 R5.1
N$73
  Top 0.254: D1.A 49.53,127.63 OK1.3 53.34,127.63 54.61,128.91 54.61,137.16 X1.5
N$74
  Top 0.305: IC4.7 R16.1 210.82,129.54 210.82,131.44 211.46,132.08 216.53,132.08 217.17,131.44 C9.2 215.9,129.54 215.9,127 R22.2
N$75
  Top 0.254: R45.2 214.63,46.99 214.63,27.94 208.28,21.59 LED5.A
N$76
  Top 0.305: R16.2 218.44,129.54 218.44,132.08 210.82,139.7 J8.T
N$78
  Top 0.254: R43.2 214,45.09 214,28.57 207.01,21.59 207.01,16.51 LED3.A
N$79
  Top 0.61: U$13.15 219.38,87 221.62,87 222.88,88.27 222.88,94.61 214.63,102.87 R26.2
N$80
  Top 0.254: LED1.A 209.55,11.43 209.55,21.59 215.27,27.3 215.27,48.26 212.72,50.8 211.46,50.8 210.82,50.16 210.82,45.72 R37.2
N$81
  Top 0.305: IC1.6 IC1.7
N$82
  Top 0.254: IC10.13 10.16,22.86 9.02,21.72 Q1.1 4.95,21.72 3.81,22.86 C33.2
N$83
  Top 0.254: C31.2 3.81,25.4 4.95,26.54 Q1.2 9.02,26.54 10.16,25.4 IC10.12
N$84
  Top 0.254: LED6.A 203.2,29.85 211.46,38.1 212.72,38.1 213.36,38.73 213.36,40.64 R35.2
N$85
  Top 0.254: LED4.A 201.93,16.51 201.93,29.85 211.46,39.37 R33.2
N$86
  Top 0.254: LED2.A 204.47,11.43 204.47,29.85 211.46,36.83 R31.2
N$87
  Top 0.254: IC14.9 120.65,31.75 124.46,35.56 124.46,36.83 125.73,38.1 128.27,38.1 130.81,35.56 142.88,35.56 145.41,33.02 194.94,33.02 196.85,34.92 196.85,42.54 194.94,44.45 IC13.14
N$88  (via drill 0.6)
  Top 0.254: IC12.12 43.81,20.32 45.09,19.05 47.62,19.05 50.17,16.51 v53.97,16.51 | RN2.8 53.97,30.48 55.88,28.57 55.88,23.5 60.96,18.42 170.81,18.42 v171.45,17.78 171.5,17.78
  Bottom 0.254: v53.97,16.51 54.61,17.14 54.61,28.57 52.7,30.48 RN2.8 | S2.4 171.45,21.44 v171.45,17.78 171.45,9.04 S2.3
N$89
  Top 0.254: IC13.2 201.93,46.99 R37.1
N$90  (via drill 0.6)
  Top 0.254: IC12.13 43.81,22.86 45.09,21.59 47.62,21.59 50.17,19.05 v53.34,19.05 | RN2.7 53.97,27.94 55.25,26.67 55.25,22.86 60.33,17.78 153.03,17.78 v153.67,17.14
  Bottom 0.254: v53.34,19.05 53.97,19.69 53.97,26.67 52.7,27.94 RN2.7 | S3.4 153.67,21.44 v153.67,17.14 153.72,17.09 S3.3
N$95  (via drill 0.6)
  Top 0.254: IC12.6 47.62,17.78 50.17,15.24 RN2.2 55.25,15.24 55.88,14.6 64.14,14.6 64.45,14.29 v64.77,14.29
  Bottom 0.254: S8.4 64.77,21.44 v64.77,14.29 64.77,9.04 S8.3
N$96
  Top 0.254: LED7.A 205.74,29.85 210.19,34.29 R29.2
N$98
  Top 0.254: IC13.6 201.93,36.83 R29.1
POTS0  (via drill 0.6)
  Top 0.254: IC10.40 31.75,53.34 34.93,56.52 34.93,94.61 37.47,97.16 72.39,97.16 v73.03,97.79
  Bottom 0.254: v73.03,97.79 R51.P$2
POTS1  (via drill 0.6)
  Top 0.254: IC10.39 30.48,50.8 35.56,55.88 35.56,93.98 38.1,96.52 109.22,96.52 v110.49,97.79
  Bottom 0.254: v110.49,97.79 R50.P$2
POTS2
  Top 0.254: IC10.38 29.21,48.26 36.2,55.24 36.2,93.34 38.73,95.88 142.88,95.88 147.96,100.97 R49.P$2
POTS3
  Top 0.254: IC10.37 27.94,45.72 36.83,54.61 36.83,92.71 39.37,95.25 179.71,95.25 185.42,100.97 R48.P$2
POTS4
  Top 0.254: IC10.36 31.75,43.18 38.73,50.16 111.12,50.16 116.21,55.24 139.7,55.24 144.15,50.8 179.57,50.8 185.42,44.95 R39.P$2
POTS5
  Top 0.254: IC10.35 30.48,40.64 39.37,49.53 111.76,49.53 116.84,54.61 139.06,54.61 147.96,45.72 R40.P$2
POTS6
  Top 0.254: IC10.34 29.21,38.1 40.01,48.89 107.95,48.89 110.49,46.35 R41.P$2
POTS7
  Top 0.254: IC10.33 27.94,35.56 40.64,48.26 70.48,48.26 73.03,45.72 R42.P$2
RESET
  Top 0.254: C25.1 R27.1 7.62,43.81 U1.5
  Bottom 0.254: IC10.9 10.16,33.02 5.71,37.46 5.71,41.91 U1.5
SCK  (via drill 0.6)
  Top 0.254: IC10.8 13.33,35.56 17.78,40 17.78,67.94 v18.41,68.58 18.41,69.22 33.66,84.45 v33.66,93.98 33.66,94.61 38.1,99.06 v85.09,99.06 139.06,99.06 144.15,104.14 147.96,104.14 | 147.96,104.14 153.67,104.14 154.94,102.87 177.8,102.87 179.07,104.14 204.47,104.14 214.63,114.3 JP6.5 | 147.96,104.14 v147.96,104.77 | v85.09,107.31 85.09,109.86 80.01,114.94 JP2.5
  Bottom 0.254: IC10.8 10.16,35.56 8.89,36.83 8.89,38.73 U1.3 | JP4.5 147.32,107.31 147.96,106.68 v147.96,104.77 | v85.09,99.06 v85.09,107.31 | v33.66,93.98 7.62,93.98 6.35,95.25 IC7.5 | v18.41,68.58 10.16,68.58 7.62,66.04 JP7.1
SCK_3V3  (via drill 0.6)
  Top 0.254: v22.86,120.02 17.14,120.02 8.89,111.76 8.89,109.22 7.62,107.95 7.62,105.41 6.35,104.14 3.81,104.14 3.17,103.5 3.17,98.42 3.81,97.79 IC7.4
  Bottom 0.254: v22.86,120.02 22.86,124.75 U$22.5
SS
  Top 0.254: IC10.5 12.7,43.18 14.6,45.09 14.6,55.88 13.33,57.15 13.33,80.01 16.51,83.19 16.51,96.52 17.78,97.79 IC8.4
SS0
  Top 0.254: IC8.15 27.94,102.87 32.38,107.31 63.5,107.31 69.85,113.66 JP2.1
SS1
  Top 0.254: IC8.14 27.94,100.33 28.58,100.97 28.58,102.23 33.02,106.68 69.85,106.68 72.39,109.22 JP2.2
SS2
  Top 0.254: IC8.13 27.94,97.79 29.21,99.06 29.21,101.6 33.66,106.05 134.62,106.05 137.16,108.58 JP4.1
SS3
  Top 0.254: IC8.12 27.94,95.25 29.84,97.16 29.84,100.97 34.29,105.41 135.25,105.41 139.7,109.86 JP4.2
SS4
  Top 0.254: IC8.11 27.94,92.71 30.48,95.25 30.48,100.33 34.93,104.77 135.89,104.77 142.88,111.76 153.03,111.76 158.75,106.05 174.62,106.05 175.9,107.31 202.56,107.31 204.47,109.22 JP6.1
SS5
  Top 0.254: IC8.10 31.12,94.61 31.12,99.69 35.56,104.14 136.53,104.14 139.7,107.31 144.78,107.31 145.41,107.95 150.5,107.95 151.77,106.68 156.21,106.68 157.48,105.41 175.26,105.41 176.53,106.68 203.2,106.68 207.01,110.49 JP6.2
SS6  (via drill 0.6)
  Top 0.254: IC8.9 22.86,87.63 14.6,79.38 v14.6,72.39
  Bottom 0.254: JP7.4 7.62,73.66 8.89,72.39 v14.6,72.39
SS7
  Bottom 0.254: IC7.7 6.35,90.17 7.62,91.44 14.6,91.44 15.87,90.17 IC8.7
SS7_3V3  (via drill 0.6)
  Top 0.254: v33.02,121.28 29.84,118.11 17.78,118.11 10.16,110.49 10.16,107.95 8.89,106.68 8.89,95.25 6.35,92.71 IC7.6
  Bottom 0.254: v33.02,121.28 32.94,121.37 U$22.1
SS_ADDR0
  Top 0.254: IC10.1 11.43,81.91 14.6,85.09 14.6,102.23 17.78,105.41 IC8.1
SS_ADDR1
  Top 0.254: IC8.2 17.78,102.87 15.24,100.33 15.24,84.45 12.06,81.28 12.06,55.88 13.33,54.61 13.33,51.43 12.7,50.8 IC10.2
SS_ADDR2
  Top 0.254: IC10.3 12.7,48.26 13.97,49.53 13.97,55.24 12.7,56.52 12.7,80.64 15.87,83.82 15.87,98.42 17.78,100.33 IC8.3
VCC  (via drill 0.6)
  Top 0.61: C4.1 IC2.8 144.78,130.81 140.97,134.62 136.53,134.62 134.62,136.53 v134.62,143.51 | C6.1 IC3.8 173.99,130.81 | JP5.3 191.77,114.94 190.5,113.66 179.07,113.66 v173.99,118.75 | JP1.3 57.15,114.3 56.52,113.66 51.44,113.66 50.17,114.94 50.17,116.2 53.66,119.7 69.53,119.7 85.72,135.89 v85.72,139.06 | C8.1 IC4.8 206.38,131.44 206.38,139.06 209.55,142.24 v222.25,142.24 | 123.19,130.81 v123.19,125.73 | 123.19,130.81 121.92,132.08 C2.1 121.92,134.62 120.02,136.53 118.75,136.53 117.47,137.79 v117.47,143.51 | 123.19,130.81 IC1.8 | v171.45,143.51 171.45,135.89 173.99,133.35 173.99,130.81 | 173.99,130.81 v173.99,122.55
  Top 1.016: v217.17,147.32 v205.74,147.32 v171.45,147.32 v134.62,147.32 v117.47,147.32 90.17,147.32 v85.72,142.88 | v222.25,142.24 229.24,135.25 229.24,65.41 231.14,63.5 C26.+ IC9.OUT 237.49,62.23 D6.A D7.C
  Bottom 0.61: JP3.3 124.46,116.84 123.19,118.11 v123.19,125.73 | v173.99,122.55 v173.99,118.75 | v85.72,142.88 v85.72,139.06 | v134.62,147.32 v134.62,143.51 | v171.45,147.32 v171.45,143.51 | v117.47,147.32 v117.47,143.51
  Bottom 1.016: v217.17,147.32 v222.25,142.24
VEE  (via drill 0.6)
  Top 0.61: 200.98,145.41 200.98,124.14 200.03,123.19 IC4.4 C18.2 | 169.54,145.41 169.54,135.25 171.45,133.35 171.45,125.73 IC3.4 C16.2 | 132.08,145.41 132.72,145.41 132.72,136.53 135.89,133.35 138.43,133.35 140.97,130.81 140.97,125.73 IC2.4 C14.2 | v120.65,123.19 IC1.4 C12.2 | v120.65,125.73 120.65,130.81 119.38,132.08 118.75,132.08 116.84,133.98 116.84,135.89 112.39,140.34 112.39,145.41 | v196.85,120.02 JP5.5 | JP1.5 62.23,114.3 60.33,112.39 50.8,112.39 48.9,114.3 48.9,116.84 53.02,120.97 69.22,120.97 84.45,136.21 84.45,139.7 90.17,145.41 90.81,145.41
  Top 1.016: 90.81,145.41 112.39,145.41 132.08,145.41 169.54,145.41 200.98,145.41 221.62,145.41 231.14,135.89 231.14,81.91 C22.- IC6.OUT 238.76,81.28 242.57,77.47 D4.C D5.A
  Bottom 0.61: v120.65,123.19 v120.65,125.73 | JP3.5 129.54,116.84 C14.2 | C18.2 v196.85,120.02

## Text on the board
tNames: In | Out | Port 1-2 | Port 3-4 | Port 5-6 | Port 7 | +5V | GND | SS | MOSI | MISO | SCK | 1
bNames: 1 | 2 | 3 | 4 | 5 | 6 | In | Out | 9VAC 1A | Contrast
200bmp: Mutable Instruments | Ambika-6 Polyphonic | cc-by-sa, Olivier Gillet. v0.7